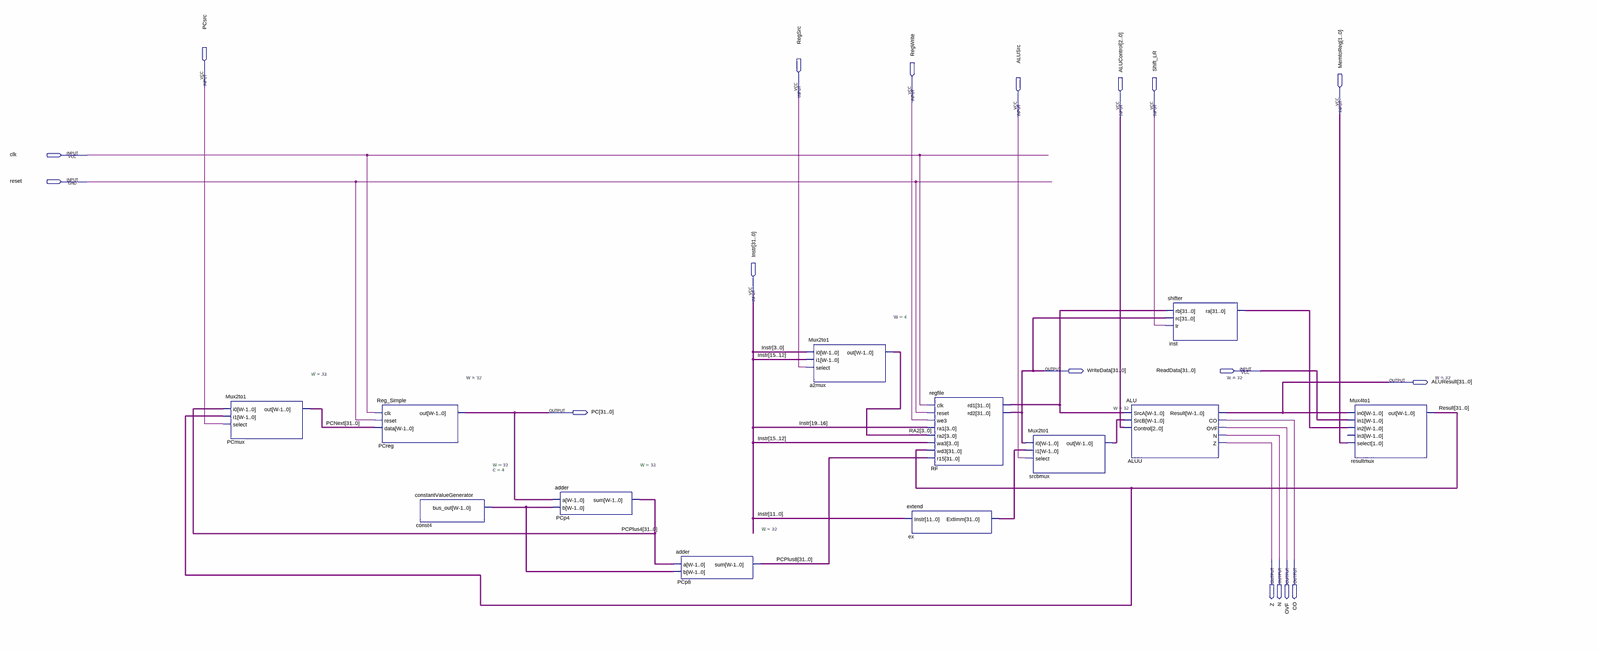
[diagram p0: schematic sheet, whole]
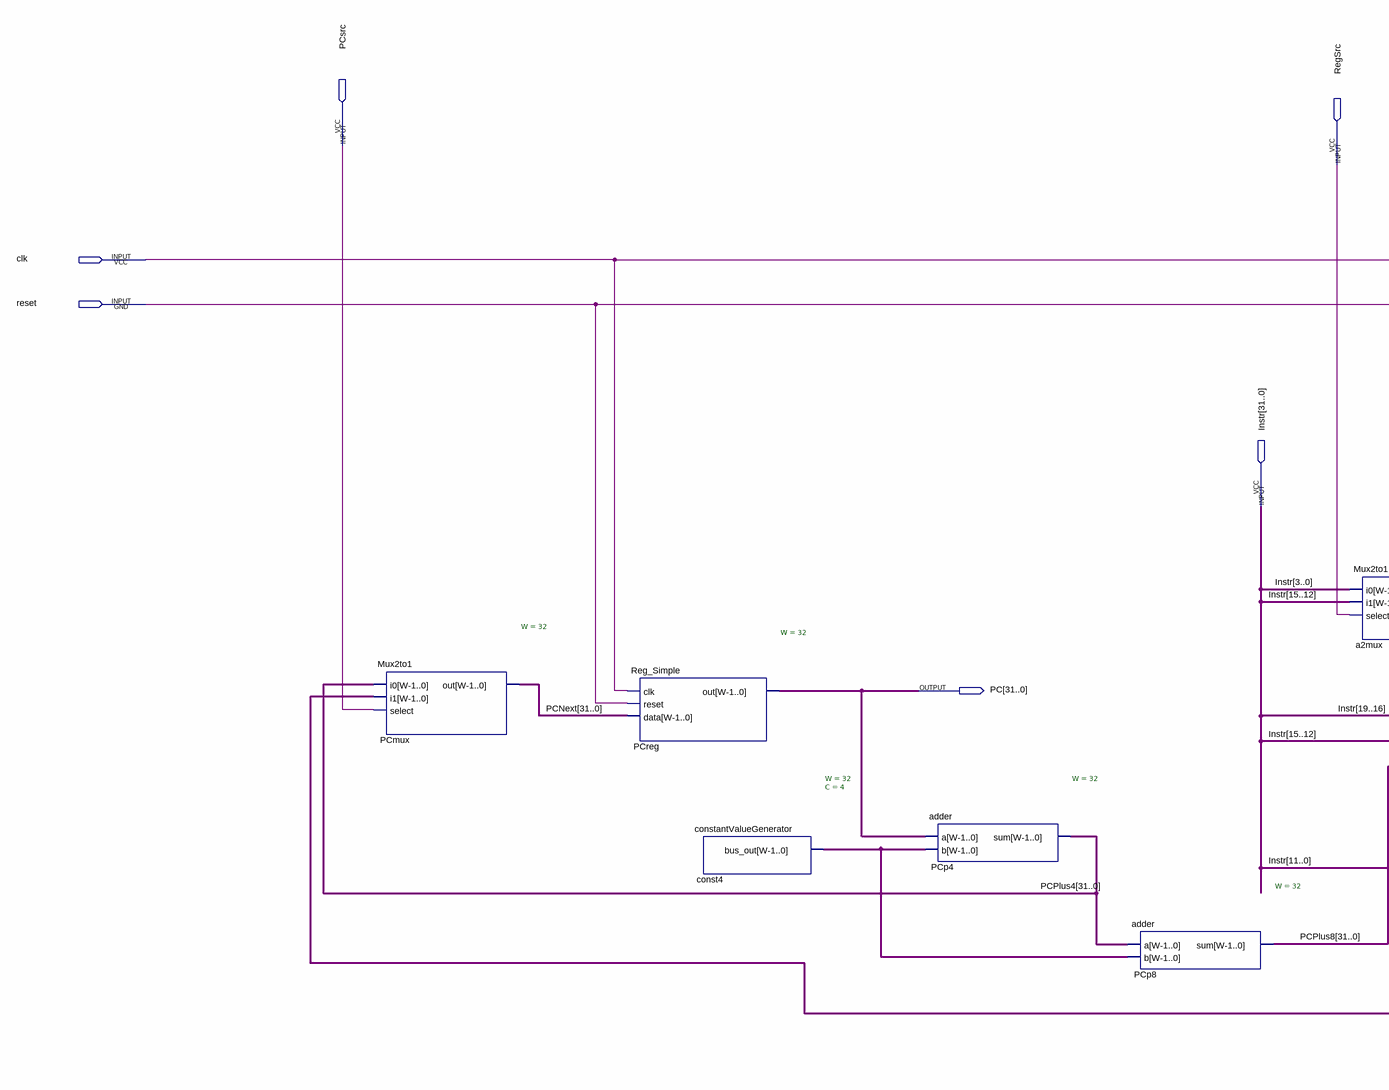
[diagram p1: schematic sheet, left part]
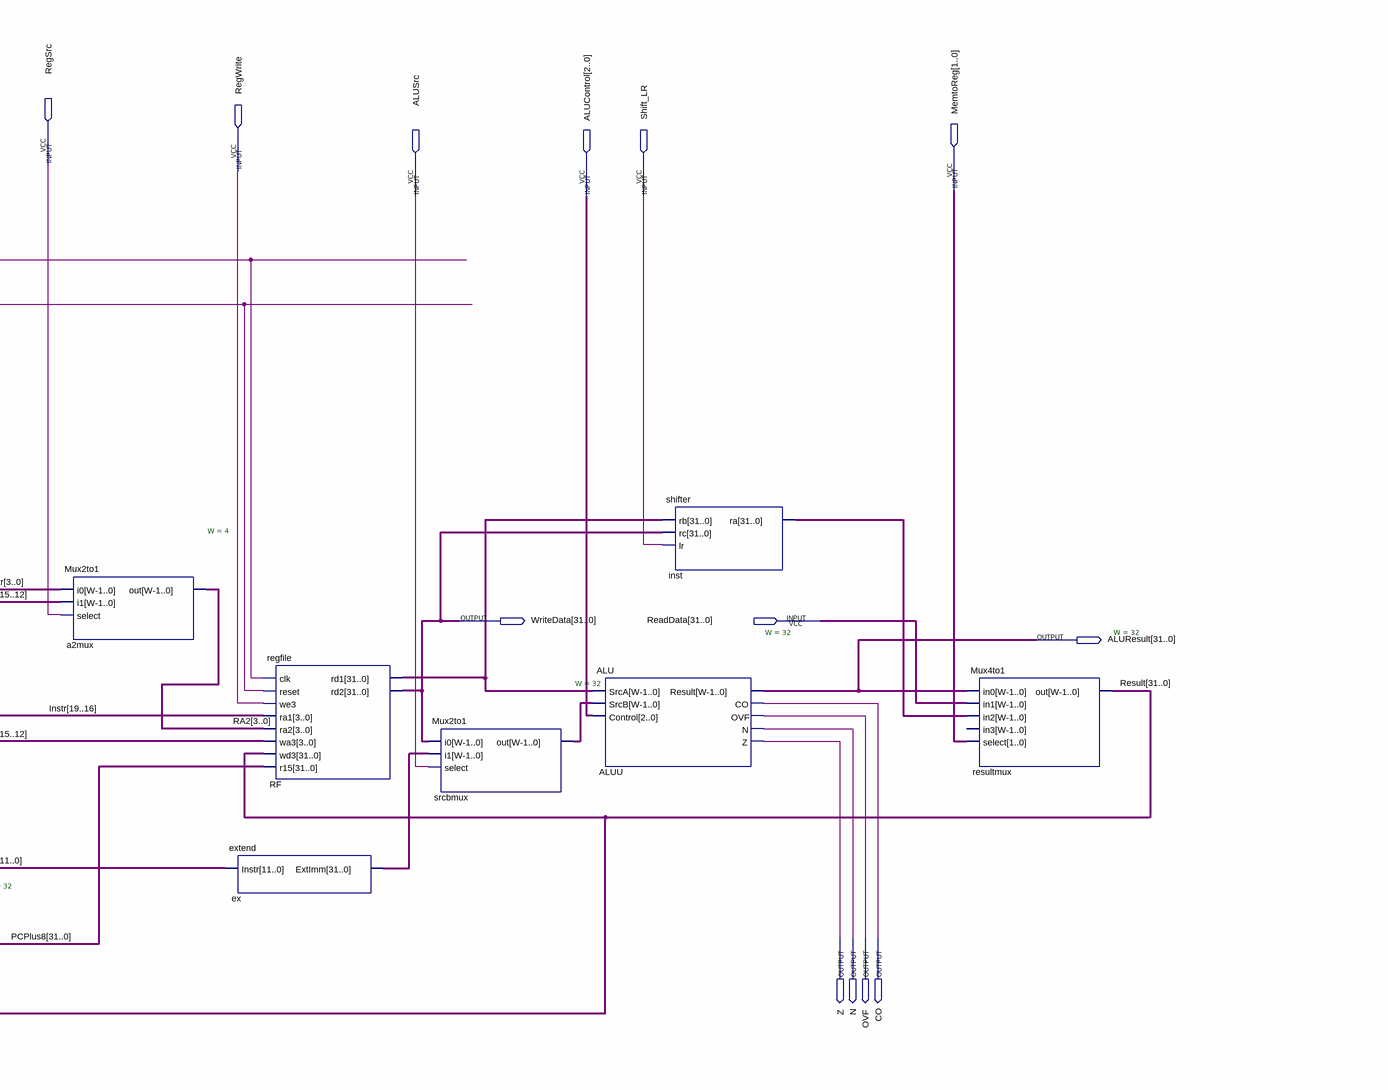
[diagram p2: schematic sheet, right part]
// Quartus schematic datapath.bdf as structural Verilog: 12 symbols, 18 pins
module datapath (
  input  PCsrc,
  input  RegSrc,
  input  RegWrite,
  input  [1:0] MemtoReg,
  input  ALUSrc,
  input  [2:0] ALUControl,
  input  Shift_LR,
  input  clk,
  input  reset,
  input  [31:0] Instr,
  input  [31:0] ReadData,
  output [31:0] WriteData,
  output [31:0] ALUResult,
  output [31:0] PC,
  output Z,
  output N,
  output OVF,
  output CO
);

  wire [3:0] RA2;
  wire [31:0] const4_bus_out, ex_extimm, inst_ra, PCNext, PCPlus4, PCPlus8, Result, RF_rd1, srcbmux_out;

  Mux2to1 #(.W(32)) PCmux (.i0(PCPlus4), .i1(Result), .select(PCsrc), .out(PCNext));
  Reg_Simple #(.W(32)) PCreg (.clk(clk), .reset(reset), .data(PCNext), .out(PC));
  constantValueGenerator #(.W(32), .C(4)) const4 (.bus_out(const4_bus_out));
  adder #(.W(32)) PCp4 (.a(PC), .b(const4_bus_out), .sum(PCPlus4));
  adder #(.W(32)) PCp8 (.a(PCPlus4), .b(const4_bus_out), .sum(PCPlus8));
  Mux2to1 #(.W(4)) a2mux (.i0(Instr[3:0]), .i1(Instr[15:12]), .select(RegSrc), .out(RA2));
  regfile RF (
    .clk(clk), .reset(reset), .we3(RegWrite), .ra1(Instr[19:16]), .ra2(RA2), .wa3(Instr[15:12]),
    .wd3(Result), .r15(PCPlus8), .rd1(RF_rd1), .rd2(WriteData));
  extend ex (.Instr(Instr[11:0]), .ExtImm(ex_extimm));
  Mux2to1 #(.W(32)) srcbmux (.i0(WriteData), .i1(ex_extimm), .select(ALUSrc), .out(srcbmux_out));
  ALU #(.W(32)) ALUU (
    .SrcA(RF_rd1), .SrcB(srcbmux_out), .Control(ALUControl), .Result(ALUResult), .CO(CO), .OVF(OVF), .N(N),
    .Z(Z));
  shifter inst (.rb(RF_rd1), .rc(WriteData), .lr(Shift_LR), .ra(inst_ra));
  Mux4to1 #(.W(32)) resultmux (
    .in0(ALUResult), .in1(ReadData), .in2(inst_ra), .select(MemtoReg), .out(Result));  // open: in3
endmodule
